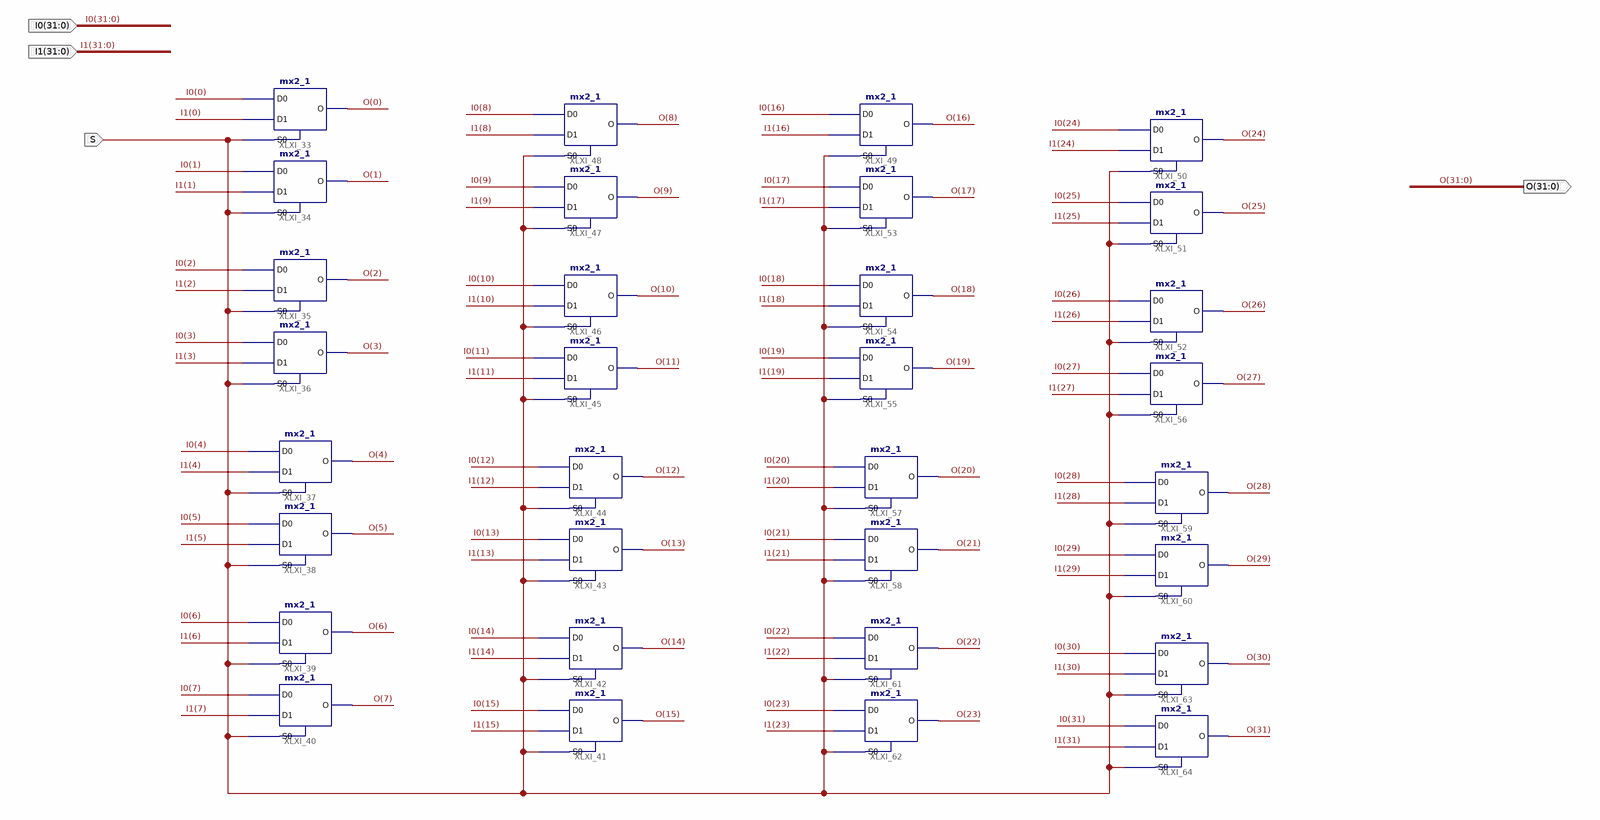
[diagram p0: schematic sheet 1]
// Xilinx ISE schematic mx2_1_32.sch (spartan3e) as structural Verilog: 32 symbols, 4 ports
module mx2_1_32 (
  input  S,
  input  [31:0] I0,
  input  [31:0] I1,
  output [31:0] O
);

  mx2_1 XLXI_33 (.D0(I0[0]), .D1(I1[0]), .S0(S), .O(O[0]));
  mx2_1 XLXI_34 (.D0(I0[1]), .D1(I1[1]), .S0(S), .O(O[1]));
  mx2_1 XLXI_35 (.D0(I0[2]), .D1(I1[2]), .S0(S), .O(O[2]));
  mx2_1 XLXI_36 (.D0(I0[3]), .D1(I1[3]), .S0(S), .O(O[3]));
  mx2_1 XLXI_37 (.D0(I0[4]), .D1(I1[4]), .S0(S), .O(O[4]));
  mx2_1 XLXI_38 (.D0(I0[5]), .D1(I1[5]), .S0(S), .O(O[5]));
  mx2_1 XLXI_39 (.D0(I0[6]), .D1(I1[6]), .S0(S), .O(O[6]));
  mx2_1 XLXI_40 (.D0(I0[7]), .D1(I1[7]), .S0(S), .O(O[7]));
  mx2_1 XLXI_41 (.D0(I0[15]), .D1(I1[15]), .S0(S), .O(O[15]));
  mx2_1 XLXI_42 (.D0(I0[14]), .D1(I1[14]), .S0(S), .O(O[14]));
  mx2_1 XLXI_43 (.D0(I0[13]), .D1(I1[13]), .S0(S), .O(O[13]));
  mx2_1 XLXI_44 (.D0(I0[12]), .D1(I1[12]), .S0(S), .O(O[12]));
  mx2_1 XLXI_45 (.D0(I0[11]), .D1(I1[11]), .S0(S), .O(O[11]));
  mx2_1 XLXI_46 (.D0(I0[10]), .D1(I1[10]), .S0(S), .O(O[10]));
  mx2_1 XLXI_47 (.D0(I0[9]), .D1(I1[9]), .S0(S), .O(O[9]));
  mx2_1 XLXI_48 (.D0(I0[8]), .D1(I1[8]), .S0(S), .O(O[8]));
  mx2_1 XLXI_49 (.D0(I0[16]), .D1(I1[16]), .S0(S), .O(O[16]));
  mx2_1 XLXI_50 (.D0(I0[24]), .D1(I1[24]), .S0(S), .O(O[24]));
  mx2_1 XLXI_51 (.D0(I0[25]), .D1(I1[25]), .S0(S), .O(O[25]));
  mx2_1 XLXI_52 (.D0(I0[26]), .D1(I1[26]), .S0(S), .O(O[26]));
  mx2_1 XLXI_53 (.D0(I0[17]), .D1(I1[17]), .S0(S), .O(O[17]));
  mx2_1 XLXI_54 (.D0(I0[18]), .D1(I1[18]), .S0(S), .O(O[18]));
  mx2_1 XLXI_55 (.D0(I0[19]), .D1(I1[19]), .S0(S), .O(O[19]));
  mx2_1 XLXI_56 (.D0(I0[27]), .D1(I1[27]), .S0(S), .O(O[27]));
  mx2_1 XLXI_57 (.D0(I0[20]), .D1(I1[20]), .S0(S), .O(O[20]));
  mx2_1 XLXI_58 (.D0(I0[21]), .D1(I1[21]), .S0(S), .O(O[21]));
  mx2_1 XLXI_59 (.D0(I0[28]), .D1(I1[28]), .S0(S), .O(O[28]));
  mx2_1 XLXI_60 (.D0(I0[29]), .D1(I1[29]), .S0(S), .O(O[29]));
  mx2_1 XLXI_61 (.D0(I0[22]), .D1(I1[22]), .S0(S), .O(O[22]));
  mx2_1 XLXI_62 (.D0(I0[23]), .D1(I1[23]), .S0(S), .O(O[23]));
  mx2_1 XLXI_63 (.D0(I0[30]), .D1(I1[30]), .S0(S), .O(O[30]));
  mx2_1 XLXI_64 (.D0(I0[31]), .D1(I1[31]), .S0(S), .O(O[31]));
endmodule
